# Altium schematic sheet BalEv_AINb_v1_0.SchDoc
size A3; CompanyName: HESSO; Address1: Route du Rawyl 47; Address2: 1950 Sion; Address3: Switzerland; DocumentNumber: 3; SheetNumber: 7; SheetTotal: 8; PageSetup: Record=PageOptions|CenterHorizontal=True|CenterVertical=True|PrintScale=1.00|XCorrection=1.00|YCorrection=1.00|PrintKind=1|BorderSize=5000000|LeftOffset=0|BottomOffset=0|Orientation=2|PaperLength=1000|PaperWidth=1000|Scale=100|PaperSource=15|PrintQuality=1200|MediaType=1|DitherType=10|PrintScaleMode=1|PaperKind=A4|PaperIndex=9; ProjectName: Project Name
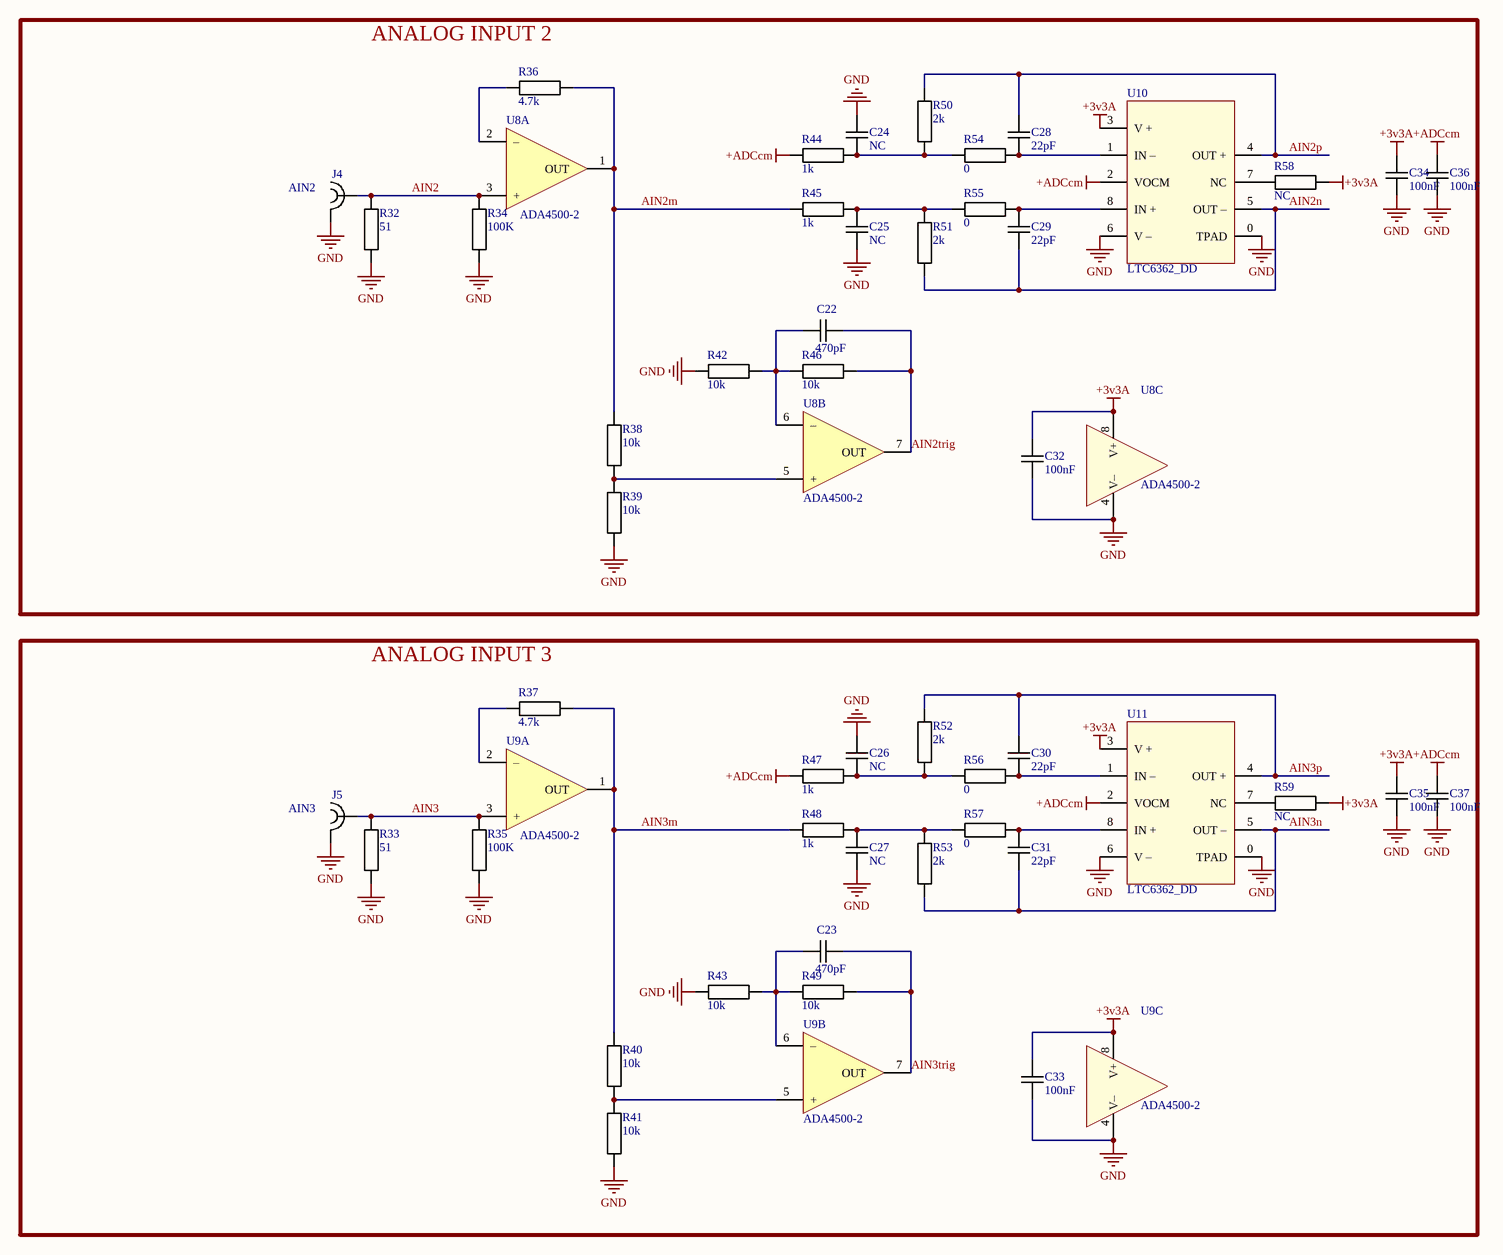
[diagram p0: BalEv_AINb_v1_0.SchDoc]

## Parts
C22  470pF  [CAPACITOR 1005 REFLOW]
C23  470pF  [CAPACITOR 1005 REFLOW]
C24  NC  [CAPACITOR 1005 REFLOW]
C25  NC  [CAPACITOR 1005 REFLOW]
C26  NC  [CAPACITOR 1005 REFLOW]
C27  NC  [CAPACITOR 1005 REFLOW]
C28  22pF  [CAPACITOR 1005 REFLOW]
C29  22pF  [CAPACITOR 1005 REFLOW]
C30  22pF  [CAPACITOR 1005 REFLOW]
C31  22pF  [CAPACITOR 1005 REFLOW]
C32  100nF  [CAPACITOR 1005 REFLOW]
C33  100nF  [CAPACITOR 1005 REFLOW]
C34  100nF  [CAPACITOR 1005 REFLOW]
C35  100nF  [CAPACITOR 1005 REFLOW]
C36  100nF  [CAPACITOR 1005 REFLOW]
C37  100nF  [CAPACITOR 1005 REFLOW]
J4  AIN2  [SMA EDGE Molex 732511150]
J5  AIN3  [SMA EDGE Molex 732511150]
R32  51  [RESISTOR 1005 REFLOW]
R33  51  [RESISTOR 1005 REFLOW]
R34  100K  [RESISTOR 1005 REFLOW]
R35  100K  [RESISTOR 1005 REFLOW]
R36  4.7k  [RESISTOR 1005 REFLOW]
R37  4.7k  [RESISTOR 1005 REFLOW]
R38  10k  [RESISTOR 1005 REFLOW]
R39  10k  [RESISTOR 1005 REFLOW]
R40  10k  [RESISTOR 1005 REFLOW]
R41  10k  [RESISTOR 1005 REFLOW]
R42  10k  [RESISTOR 1005 REFLOW]
R43  10k  [RESISTOR 1005 REFLOW]
R44  1k  [RESISTOR 1005 REFLOW]
R45  1k  [RESISTOR 1005 REFLOW]
R46  10k  [RESISTOR 1005 REFLOW]
R47  1k  [RESISTOR 1005 REFLOW]
R48  1k  [RESISTOR 1005 REFLOW]
R49  10k  [RESISTOR 1005 REFLOW]
R50  2k  [RESISTOR 1005 REFLOW]
R51  2k  [RESISTOR 1005 REFLOW]
R52  2k  [RESISTOR 1005 REFLOW]
R53  2k  [RESISTOR 1005 REFLOW]
R54  0  [RESISTOR 1005 REFLOW]
R55  0  [RESISTOR 1005 REFLOW]
R56  0  [RESISTOR 1005 REFLOW]
R57  0  [RESISTOR 1005 REFLOW]
R58  NC  [RESISTOR 1005 REFLOW]
R59  NC  [RESISTOR 1005 REFLOW]
U8  ADA4500-2  [MSOP8 P0.65 C3.0X3.0 H1.1]  (parts A,B,C of 3)
U9  ADA4500-2  [MSOP8 P0.65 C3.0X3.0 H1.1]  (parts A,B,C of 3)
U10  LTC6362_DD  [LFCSP8 P0.5 C3.0x2.8 H1.0]
U11  LTC6362_DD  [LFCSP8 P0.5 C3.0x2.8 H1.0]

## Blocks framed on the sheet
ANALOG INPUT 2: C22 C24 C25 C28 C29 C32 C34 C36 J4 R32 R34 R36 R38 R39 R42 R44-R46 R50 R51 R54 R55 R58 U8 U10
ANALOG INPUT 3: C23 C26 C27 C30 C31 C33 C35 C37 J5 R33 R35 R37 R40 R41 R43 R47-R49 R52 R53 R56 R57 R59 U9 U11

## Nets
+3v3A: C32.1 C33.1 C34.2 C35.2 R58.2 R59.2 U8.8(V+) U9.8(V+) U10.3(V_+) U11.3(V_+)
+ADCcm: C36.2 C37.2 R44.1 R47.1 U10.2(VOCM) U11.2(VOCM)
GND: C24.1 C25.2 C26.1 C27.2 C32.2 C33.2 C34.1 C35.1 C36.1 C37.1 J4.2 J5.2 R32.1 R33.1 R34.1 R35.1 R39.2 R41.2 R42.1 R43.1 U8.4(V–) U9.4(V–) U10.0(TPAD) U10.6(V_–) U11.0(TPAD) U11.6(V_–)
AIN2: J4.1 R32.2 R34.2 U8.3(+)
AIN2m: R36.2 R38.1 R45.1 U8.1(OUT)
AIN2n: C29.1 R51.2 U10.5(OUT_–)
AIN2p: C28.1 R50.2 U10.4(OUT_+)
AIN2trig: C22.1 R46.2 U8.7(OUT)
AIN3: J5.1 R33.2 R35.2 U9.3(+)
AIN3m: R37.2 R40.1 R48.1 U9.1(OUT)
AIN3n: C31.1 R53.2 U11.5(OUT_–)
AIN3p: C30.1 R52.2 U11.4(OUT_+)
AIN3trig: C23.1 R49.2 U9.7(OUT)
NetC22_2: C22.2 R42.2 R46.1 U8.6(–)
NetC23_2: C23.2 R43.2 R49.1 U9.6(–)
NetC24_2: C24.2 R44.2 R50.1 R54.2
NetC25_1: C25.1 R45.2 R51.1 R55.1
NetC26_2: C26.2 R47.2 R52.1 R56.2
NetC27_1: C27.1 R48.2 R53.1 R57.1
NetC28_2: C28.2 R54.1 U10.1(IN_–)
NetC29_2: C29.2 R55.2 U10.8(IN_+)
NetC30_2: C30.2 R56.1 U11.1(IN_–)
NetC31_2: C31.2 R57.2 U11.8(IN_+)
NetR36_1: R36.1 U8.2(–)
NetR37_1: R37.1 U9.2(–)
NetR38_2: R38.2 R39.1 U8.5(+)
NetR40_2: R40.2 R41.1 U9.5(+)
NetR58_1: R58.1 U10.7(NC)
NetR59_1: R59.1 U11.7(NC)

## Notes on the sheet
- Date :
- Revision :
- Sheet
- of
- Design by :

## Library data of the parts
C22-C37 = Capacitor
  C22 C23: Value: 470pF
  C24-C27: Value: NC
  C28-C31: Value: 22pF
  C32-C37: Value: 100nF
J4 J5 = SMA EDGE Molex 732511150
  J4: Value: AIN2
  J5: Value: AIN3
R32-R59 = Resistor
  R32 R33: Value: 51
  R34 R35: Value: 100K
  R36 R37: Value: 4.7k
  R38-R43 R46 R49: Value: 10k
  R44 R45 R47 R48: Value: 1k
  R50-R53: Value: 2k
  R54-R57: Value: 0
  R58 R59: Value: NC
U8 U9 = OPA DUAL: Generic dual OPA 8 pins; Value: ADA4500-2
U10 U11 = AD8139ACP: IC OPAMP DIFF 410MHZ RRO 8LFCSP; Value: LTC6362_DD